# EasyEDA Pro project ProDoc_v01_PCB_Cartridge_Breakout_2025-03-17.epro

# Board v01_PCB_Cartridge_Breakout
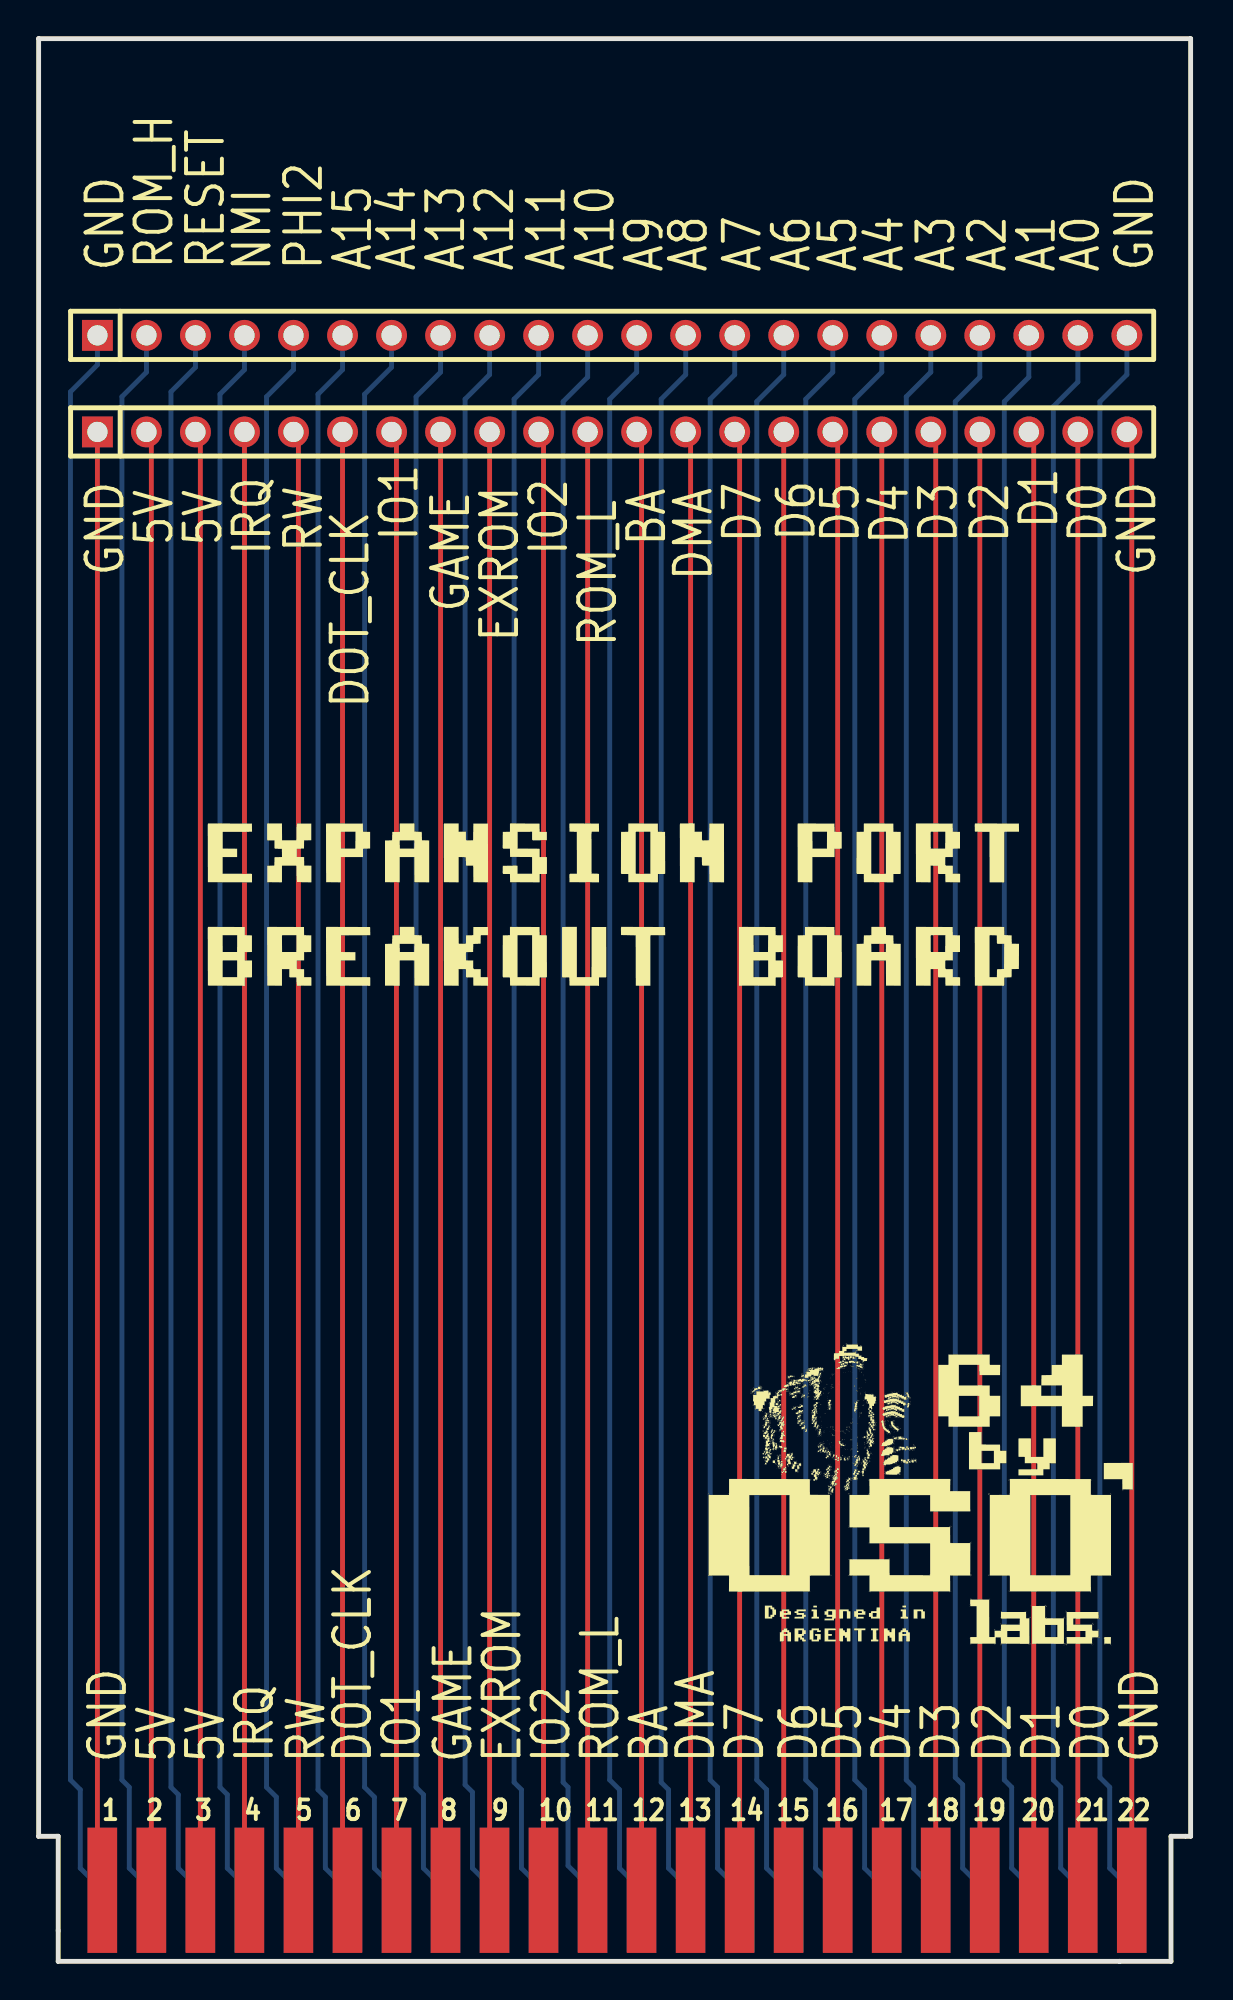
[diagram p0: board, top side]
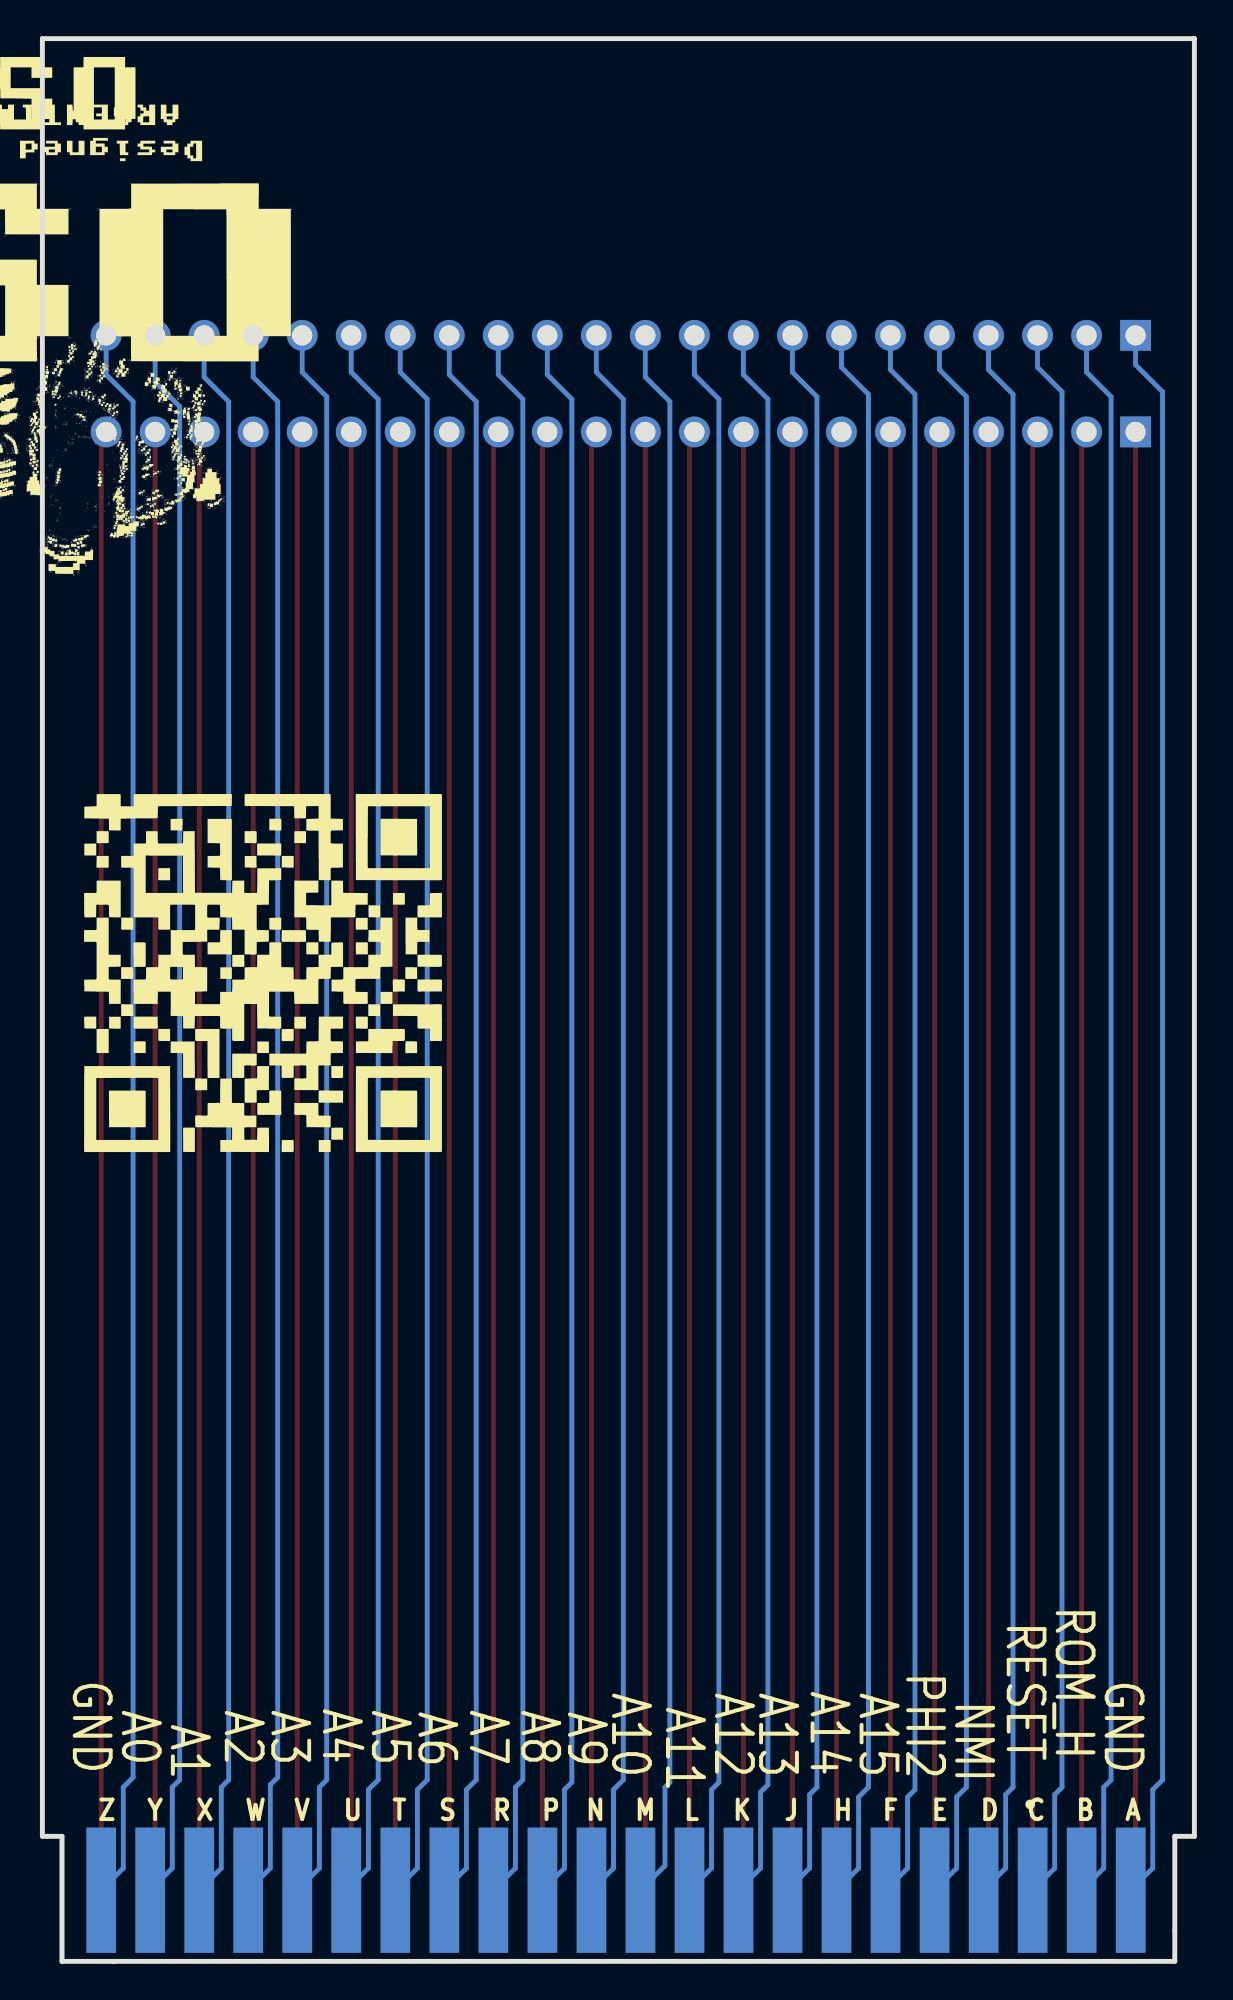
[diagram p1: board, bottom side, seen from below]

Outline 59.69 x 99.57 mm; copper layers: Top Layer, Bottom Layer. Coordinates in mm from the lower left corner of the outline.
Outline path: 0,99.57 59.69,99.57 59.69,6.48 58.67,6.48 58.67,0 1.02,0 1.02,6.48 0,6.48 0,99.57
Stack: Top Layer 0.035mm / Dielectric1 1.51mm FR4 er 4.5 / Bottom Layer 0.035mm

## Design rules (mm)
spacing Default (default): track to track 0.152, other pairs 0 to 0.152
track width Default (default): min 0.254, default 0.254, max 25.4
differential pair differentialPair (default): width min 0.127, default 0.254, max 2.54; gap min 0.152, default 0.152
via Default (default): diameter min 0.61, default 0.61, max 100.025; hole min 0.305, default 0.305, max 59.995

## Placement (name value [footprint] x y rotation side)
H1  X6511WV-22H-C30D60  [HDR-TH_22P-P2.54-V-M]  29.72 84.2 0 top
H2  X6511WV-22H-C30D60  [HDR-TH_22P-P2.54-V-M]  29.72 79.2 0 top
NOREF  -  [Pad_e263]  26.16 3.68 0 top
NOREF#2  -  [Pad_e257]  10.92 3.68 0 top
NOREF#3  -  [Pad_e255]  5.84 3.68 0 top
NOREF#4  -  [Pad_e265]  31.24 3.68 0 top
NOREF#5  -  [Pad_e81]  49.02 3.68 0 top
NOREF#6  -  [Pad_e69]  18.54 3.68 0 top
NOREF#7  -  [Pad_e74]  31.24 3.68 0 top
NOREF#8  -  [Pad_e273]  51.56 3.68 0 top
NOREF#9  -  [Pad_e67]  13.46 3.68 0 top
NOREF#10  -  [Pad_e274]  54.1 3.68 0 top
NOREF#11  -  [Pad_e261]  21.08 3.68 0 top
NOREF#12  -  [Pad_e254]  3.3 3.68 0 top
NOREF#13  -  [Pad_e82]  51.56 3.68 0 top
NOREF#14  -  [Pad_e272]  49.02 3.68 0 top
NOREF#15  -  [Pad_e77]  38.86 3.68 0 top
NOREF#16  -  [Pad_e264]  28.7 3.68 0 top
NOREF#17  -  [Pad_e266]  33.78 3.68 0 top
NOREF#18  -  [Pad_e65]  8.38 3.68 0 top
NOREF#19  -  [Pad_e259]  16 3.68 0 top
NOREF#20  -  [Pad_e64]  5.84 3.68 0 top
NOREF#21  -  [Pad_e68]  16 3.68 0 top
NOREF#22  -  [Pad_e262]  23.62 3.68 0 top
NOREF#23  -  [Pad_e70]  21.08 3.68 0 top
NOREF#24  -  [Pad_e260]  18.54 3.68 0 top
NOREF#25  -  [Pad_e63]  3.3 3.68 0 top
NOREF#26  -  [Pad_e268]  38.86 3.68 0 top
NOREF#27  -  [Pad_e80]  46.48 3.68 0 top
NOREF#28  -  [Pad_e72]  26.16 3.68 0 top
NOREF#29  -  [Pad_e271]  46.48 3.68 0 top
NOREF#30  -  [Pad_e79]  43.94 3.68 0 top
NOREF#31  -  [Pad_e270]  43.94 3.68 0 top
NOREF#32  -  [Pad_e78]  41.4 3.68 0 top
NOREF#33  -  [Pad_e256]  8.38 3.68 0 top
NOREF#34  -  [Pad_e84]  56.64 3.68 0 top
NOREF#35  -  [Pad_e76]  36.32 3.68 0 top
NOREF#36  -  [Pad_e258]  13.46 3.68 0 top
NOREF#37  -  [Pad_e75]  33.78 3.68 0 top
NOREF#38  -  [Pad_e71]  23.62 3.68 0 top
NOREF#39  -  [Pad_e275]  56.64 3.68 0 top
NOREF#40  -  [Pad_e269]  41.4 3.68 0 top
NOREF#41  -  [Pad_e73]  28.7 3.68 0 top
NOREF#42  -  [Pad_e267]  36.32 3.68 0 top
NOREF#43  -  [Pad_e83]  54.1 3.68 0 top
NOREF#44  -  [Pad_e66]  10.92 3.68 0 top

## Footprints (pads in the part's own frame, mm; a bottom-side part is the same pattern mirrored in y, then rotated)
HDR-TH_22P-P2.54-V-M
  rect 1.6x1.6 hole 1.05: 1(-26.67,0)
  round 1.6 hole 1.05: 2(-24.13,0) 3(-21.59,0) 4(-19.05,0) 5(-16.51,0) 6(-13.97,0) 7(-11.43,0) 8(-8.89,0) 9(-6.35,0) 10(-3.81,0) 11(-1.27,0) 12(1.27,0) 13(3.81,0) 14(6.35,0) 15(8.89,0) 16(11.43,0) 17(13.97,0) 18(16.51,0) 19(19.05,0) 20(21.59,0) 21(24.13,0) 22(26.67,0)
Pad_e63
  rect 1.536x6.489 smd far side: A(0,0)
Pad_e64
  rect 1.536x6.489 smd far side: B(0,0)
Pad_e65
  rect 1.536x6.489 smd far side: C(0,0)
Pad_e66
  rect 1.536x6.489 smd far side: D(0,0)
Pad_e67
  rect 1.536x6.489 smd far side: E(0,0)
Pad_e68
  rect 1.536x6.489 smd far side: F(0,0)
Pad_e69
  rect 1.536x6.489 smd far side: H(0,0)
Pad_e70
  rect 1.536x6.489 smd far side: J(0,0)
Pad_e71
  rect 1.536x6.489 smd far side: K(0,0)
Pad_e72
  rect 1.536x6.489 smd far side: L(0,0)
Pad_e73
  rect 1.536x6.489 smd far side: M(0,0)
Pad_e74
  rect 1.536x6.489 smd far side: N(0,0)
Pad_e75
  rect 1.536x6.489 smd far side: P(0,0)
Pad_e76
  rect 1.536x6.489 smd far side: R(0,0)
Pad_e77
  rect 1.536x6.489 smd far side: S(0,0)
Pad_e78
  rect 1.536x6.489 smd far side: T(0,0)
Pad_e79
  rect 1.536x6.489 smd far side: U(0,0)
Pad_e80
  rect 1.536x6.489 smd far side: V(0,0)
Pad_e81
  rect 1.536x6.489 smd far side: W(0,0)
Pad_e82
  rect 1.536x6.489 smd far side: X(0,0)
Pad_e83
  rect 1.536x6.489 smd far side: Y(0,0)
Pad_e84
  rect 1.536x6.489 smd far side: Z(0,0)
Pad_e254
  rect 1.536x6.489 smd: 1(0,0)
Pad_e255
  rect 1.536x6.489 smd: 2(0,0)
Pad_e256
  rect 1.536x6.489 smd: 3(0,0)
Pad_e257
  rect 1.536x6.489 smd: 4(0,0)
Pad_e258
  rect 1.536x6.489 smd: 5(0,0)
Pad_e259
  rect 1.536x6.489 smd: 6(0,0)
Pad_e260
  rect 1.536x6.489 smd: 7(0,0)
Pad_e261
  rect 1.536x6.489 smd: 8(0,0)
Pad_e262
  rect 1.536x6.489 smd: 9(0,0)
Pad_e263
  rect 1.536x6.489 smd: 10(0,0)
Pad_e264
  rect 1.536x6.489 smd: 11(0,0)
Pad_e265
  rect 1.536x6.489 smd: 12(0,0)
Pad_e266
  rect 1.536x6.489 smd: 13(0,0)
Pad_e267
  rect 1.536x6.489 smd: 14(0,0)
Pad_e268
  rect 1.536x6.489 smd: 15(0,0)
Pad_e269
  rect 1.536x6.489 smd: 16(0,0)
Pad_e270
  rect 1.536x6.489 smd: 17(0,0)
Pad_e271
  rect 1.536x6.489 smd: 18(0,0)
Pad_e272
  rect 1.536x6.489 smd: 19(0,0)
Pad_e273
  rect 1.536x6.489 smd: 20(0,0)
Pad_e274
  rect 1.536x6.489 smd: 21(0,0)
Pad_e275
  rect 1.536x6.489 smd: 22(0,0)

## Nets
5V1: H2.2 NOREF#3.2
5V2: H2.3 NOREF#33.3
GND1: H2.1 NOREF#12.1
GND2: H2.22 NOREF#39.22
GND3: H1.22 NOREF#34.Z
GND4: H1.1 NOREF#25.A
A0: H1.21 NOREF#43.Y
A1: H1.20 NOREF#13.X
A2: H1.19 NOREF#5.W
A3: H1.18 NOREF#27.V
A4: H1.17 NOREF#30.U
A5: H1.16 NOREF#32.T
A6: H1.15 NOREF#15.S
A7: H1.14 NOREF#35.R
A8: H1.13 NOREF#37.P
A9: H1.12 NOREF#7.N
A10: H1.11 NOREF#41.M
A11: H1.10 NOREF#28.L
A12: H1.9 NOREF#38.K
A13: H1.8 NOREF#23.J
A14: H1.7 NOREF#6.H
A15: H1.6 NOREF#21.F
BA: H2.12 NOREF#4.12
D0: H2.21 NOREF#10.21
D1: H2.20 NOREF#8.20
D2: H2.19 NOREF#14.19
D3: H2.18 NOREF#29.18
D4: H2.17 NOREF#31.17
D5: H2.16 NOREF#40.16
D6: H2.15 NOREF#26.15
D7: H2.14 NOREF#42.14
DMA: H2.13 NOREF#17.13
DOT_CLK: H2.6 NOREF#19.6
EXROM: H2.9 NOREF#22.9
GAME: H2.8 NOREF#11.8
I/O1: H2.7 NOREF#24.7
I/O2: H2.10 NOREF.10
IRQ: H2.4 NOREF#2.4
NMI: H1.4 NOREF#44.D
PHI2: H1.5 NOREF#9.E
R/W: H2.5 NOREF#36.5
RESET: H1.3 NOREF#18.C
ROM_H: H1.2 NOREF#20.B
ROM_L: H2.11 NOREF#16.11

## Routing (per net, layer and track width the routed paths; a pad name or vN(x,y) marks a point on that pad's centre or on a via; arc(x,y) is an arc through that point)
5V1: length 75.6
  Top Layer w0.254: NOREF#3.2 5.84,78.95 H2.2
5V2: length 75.6
  Top Layer w0.254: NOREF#33.3 8.38,78.95 H2.3
GND1: length 75.6
  Top Layer w0.254: H2.1 3.05,3.94 NOREF#12.1
GND2: length 75.6
  Top Layer w0.254: H2.22 56.64,78.95 NOREF#39.22
GND3: length 81.8
  Bottom Layer w0.254: NOREF#34.Z 55.5,4.83 55.5,9.02 54.99,9.52 54.99,80.77 56.39,82.17 H1.22
GND4: length 81.8
  Bottom Layer w0.254: H1.1 3.05,82.68 1.65,81.28 1.65,9.4 2.16,8.89 2.16,4.83 NOREF#25.A
A0: length 81.7
  Bottom Layer w0.254: H1.21 53.85,81.79 52.58,80.52 52.58,9.4 52.96,9.02 52.96,4.83 NOREF#43.Y
A1: length 81.7
  Bottom Layer w0.254: H1.20 51.31,82.04 50.04,80.77 50.04,9.4 50.42,9.02 50.42,4.83 NOREF#13.X
A2: length 81.7
  Bottom Layer w0.254: NOREF#5.W 47.88,4.83 47.88,9.14 47.5,9.52 47.5,80.77 48.77,82.04 H1.19
A3: length 81.7
  Bottom Layer w0.254: H1.18 46.23,82.3 44.96,81.03 44.96,9.4 45.34,9.02 45.34,4.83 NOREF#27.V
A4: length 81.8
  Bottom Layer w0.254: NOREF#30.U 42.8,4.83 42.8,8.89 42.29,9.4 42.29,80.9 43.69,82.3 H1.17
A5: length 81.8
  Bottom Layer w0.254: H1.16 41.15,82.3 39.75,80.9 39.75,9.4 40.26,8.89 40.26,4.83 NOREF#32.T
A6: length 81.8
  Bottom Layer w0.254: H1.15 38.61,82.17 37.21,80.77 37.21,9.4 37.72,8.89 37.72,4.83 NOREF#15.S
A7: length 81.7
  Bottom Layer w0.254: H1.14 36.07,82.17 34.8,80.9 34.8,9.4 35.18,9.02 35.18,4.83 NOREF#35.R
A8: length 81.7
  Bottom Layer w0.254: NOREF#37.P 32.64,4.83 32.64,8.89 32.26,9.27 32.26,80.9 33.53,82.17 H1.13
A9: length 81.8
  Bottom Layer w0.254: NOREF#7.N 30.1,4.83 30.1,8.89 29.59,9.4 29.59,80.9 30.99,82.3 H1.12
A10: length 81.7
  Bottom Layer w0.254: H1.11 28.45,82.04 27.18,80.77 27.18,9.27 27.43,9.02 27.43,4.95 NOREF#41.M
A11: length 81.7
  Bottom Layer w0.254: NOREF#28.L 25.02,4.83 25.02,8.89 24.64,9.27 24.64,80.9 25.91,82.17 H1.10
A12: length 81.7
  Bottom Layer w0.254: NOREF#38.K 22.48,4.83 22.48,8.76 22.1,9.14 22.1,80.9 23.37,82.17 H1.9
A13: length 81.7
  Bottom Layer w0.254: H1.8 20.83,82.3 19.56,81.03 19.56,9.02 19.94,8.64 19.94,4.83 NOREF#23.J
A14: length 81.8
  Bottom Layer w0.254: H1.7 18.29,82.55 16.89,81.15 16.89,9.02 17.4,8.51 17.4,4.83 NOREF#6.H
A15: length 81.7
  Bottom Layer w0.254: NOREF#21.F 14.86,4.83 14.86,8.51 14.48,8.89 14.48,81.15 15.75,82.42 H1.6
BA: length 75.6
  Top Layer w0.254: NOREF#4.12 31.24,78.95 H2.12
D0: length 75.6
  Top Layer w0.254: NOREF#10.21 53.85,3.94 H2.21
D1: length 75.6
  Top Layer w0.254: NOREF#8.20 51.56,78.95 H2.20
D2: length 75.6
  Top Layer w0.254: H2.19 48.77,3.94 NOREF#14.19
D3: length 75.6
  Top Layer w0.254: H2.18 46.48,78.95 NOREF#29.18
D4: length 75.6
  Top Layer w0.254: NOREF#31.17 43.69,3.94 H2.17
D5: length 75.6
  Top Layer w0.254: NOREF#40.16 41.4,78.95 H2.16
D6: length 75.6
  Top Layer w0.254: NOREF#26.15 38.61,3.94 H2.15
D7: length 75.6
  Top Layer w0.254: H2.14 36.32,78.95 NOREF#42.14
DMA: length 75.6
  Top Layer w0.254: H2.13 33.78,78.95 NOREF#17.13
DOT_CLK: length 75.6
  Top Layer w0.254: NOREF#19.6 15.75,3.94 H2.6
EXROM: length 75.6
  Top Layer w0.254: H2.9 23.37,3.94 NOREF#22.9
GAME: length 75.6
  Top Layer w0.254: H2.8 20.83,3.94 NOREF#11.8
I/O1: length 75.6
  Top Layer w0.254: H2.7 18.54,78.95 NOREF#24.7
I/O2: length 75.6
  Top Layer w0.254: NOREF.10 26.16,78.95 H2.10
IRQ: length 75.6
  Top Layer w0.254: H2.4 10.67,3.94 NOREF#2.4
NMI: length 81.7
  Bottom Layer w0.254: H1.4 10.67,82.42 9.4,81.15 9.4,9.02 9.78,8.64 9.78,4.83 NOREF#44.D
PHI2: length 81.8
  Bottom Layer w0.254: NOREF#9.E 12.32,4.83 12.32,8.51 11.81,9.02 11.81,81.03 13.21,82.42 H1.5
R/W: length 75.6
  Top Layer w0.254: NOREF#36.5 13.46,78.95 H2.5
RESET: length 81.7
  Bottom Layer w0.254: H1.3 8.13,82.55 6.86,81.28 6.86,9.02 7.24,8.64 7.24,4.83 NOREF#18.C
ROM_H: length 81.7
  Bottom Layer w0.254: NOREF#20.B 4.7,4.83 4.7,9.02 4.32,9.4 4.32,81.03 5.59,82.3 H1.2
ROM_L: length 75.6
  Top Layer w0.254: NOREF#16.11 28.45,3.94 H2.11

## Text on the board
Bottom Silkscreen Layer: A | B | C | D | E | F | H | J | K | L | M | N | P | R | S | T | U | V | W | X | Y | Z | GND | ROM_H | RESET | NMI | PHI2 | A15 | A14 | A13 | A12 | A11 | A10 | A9 | A8 | A7 | A6 | A5 | A4 | A3 | A2 | A1 | A0
Top Silkscreen Layer: 1 | 2 | 3 | 4 | 5 | 6 | 7 | 8 | 9 | 10 | 11 | 12 | 13 | 14 | 15 | 16 | 17 | 18 | 19 | 20 | 21 | 22 | GND | ROM_H | 5V | RESET | NMI | IRQ | PHI2 | RW | DOT_CLK | A15 | A14 | IO1 | A13 | GAME | A12 | EXROM | A11 | IO2 | A10 | ROM_L | A9 | BA | A8 | DMA | A7 | D7 | A6 | D6 | A5 | D5 | A4 | D4 | A3 | D3 | A2 | D2 | A1 | D1 | A0 | D0
